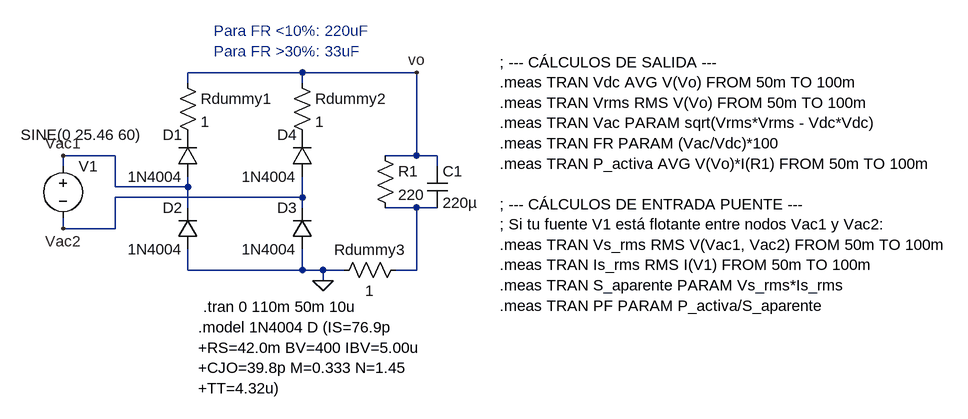
[diagram p0: schematic PuenteOndaCompleta RC.asc]
PuenteOndaCompleta RC.asc, the LTspice schematic file:
Version 4.1
SHEET 1 1284 680
WIRE 240 32 64 32
WIRE 416 32 240 32
WIRE 64 48 64 32
WIRE 240 48 240 32
WIRE -48 160 -128 160
WIRE 416 160 416 32
WIRE 416 160 368 160
WIRE 448 160 416 160
WIRE -128 176 -128 160
WIRE 448 176 448 160
WIRE -48 208 -48 160
WIRE 64 208 64 192
WIRE 64 208 -48 208
WIRE 240 224 240 192
WIRE 240 224 -48 224
WIRE 64 240 64 208
WIRE 240 240 240 224
WIRE 416 240 368 240
WIRE 448 240 416 240
WIRE -128 272 -128 256
WIRE -48 272 -48 224
WIRE -48 272 -128 272
WIRE 64 336 64 304
WIRE 240 336 240 304
WIRE 240 336 64 336
WIRE 272 336 240 336
WIRE 304 336 272 336
WIRE 416 336 416 240
WIRE 416 336 384 336
WIRE 272 352 272 336
FLAG 272 352 0
FLAG 416 32 vo
FLAG -128 160 Vac1
FLAG -128 272 Vac2
SYMBOL diode 80 192 R180
WINDOW 0 24 64 Left 2
WINDOW 3 24 0 Left 2
SYMATTR InstName D1
SYMATTR Value 1N4004
SYMBOL diode 80 304 R180
WINDOW 0 24 64 Left 2
WINDOW 3 24 0 Left 2
SYMATTR InstName D2
SYMATTR Value 1N4004
SYMBOL diode 256 304 R180
WINDOW 0 24 64 Left 2
WINDOW 3 24 0 Left 2
SYMATTR InstName D3
SYMATTR Value 1N4004
SYMBOL diode 256 192 R180
WINDOW 0 24 64 Left 2
WINDOW 3 24 0 Left 2
SYMATTR InstName D4
SYMATTR Value 1N4004
SYMBOL voltage -128 160 R0
WINDOW 3 -65 -32 Left 2
WINDOW 123 0 0 Left 0
WINDOW 39 0 0 Left 0
SYMATTR Value SINE(0 25.46 60)
SYMATTR InstName V1
SYMBOL res 48 32 R0
SYMATTR InstName Rdummy1
SYMATTR Value 1
SYMBOL res 224 32 R0
SYMATTR InstName Rdummy2
SYMATTR Value 1
SYMBOL res 400 320 R90
WINDOW 0 0 56 VBottom 2
WINDOW 3 32 56 VTop 2
SYMATTR InstName Rdummy3
SYMATTR Value 1
SYMBOL res 352 144 R0
SYMATTR InstName R1
SYMATTR Value 220
SYMBOL cap 432 176 R0
SYMATTR InstName C1
SYMATTR Value 220µ
TEXT 88 392 Left 2 !.tran 0 110m 50m 10u
TEXT 80 424 Left 2 !.model 1N4004 D (IS=76.9p \n+RS=42.0m BV=400 IBV=5.00u \n+CJO=39.8p M=0.333 N=1.45 \n+TT=4.32u)
TEXT 104 -32 Left 2 ;Para FR <10%: 220uF\nPara FR >30%: 33uF
TEXT 544 16 Left 2 !; --- CÁLCULOS DE SALIDA ---\n.meas TRAN Vdc AVG V(Vo) FROM 50m TO 100m\n.meas TRAN Vrms RMS V(Vo) FROM 50m TO 100m\n.meas TRAN Vac PARAM sqrt(Vrms*Vrms - Vdc*Vdc)\n.meas TRAN FR PARAM (Vac/Vdc)*100\n.meas TRAN P_activa AVG V(Vo)*I(R1) FROM 50m TO 100m\n \n; --- CÁLCULOS DE ENTRADA PUENTE ---\n; Si tu fuente V1 está flotante entre nodos Vac1 y Vac2:\n.meas TRAN Vs_rms RMS V(Vac1, Vac2) FROM 50m TO 100m\n.meas TRAN Is_rms RMS I(V1) FROM 50m TO 100m\n.meas TRAN S_aparente PARAM Vs_rms*Is_rms\n.meas TRAN PF PARAM P_activa/S_aparente

The netlist it stands for:
* PuenteOndaCompleta RC.asc
D1 Vac1 P001 1N4004
D2 0 Vac1 1N4004
D3 0 Vac2 1N4004
D4 Vac2 P002 1N4004
V1 Vac1 Vac2 SINE(0 25.46 60)
Rdummy1 vo P001 1
Rdummy2 vo P002 1
Rdummy3 N001 0 1
R1 vo N001 220
C1 vo N001 220µ
.model D D
.lib standard.dio
.tran 0 110m 50m 10u
.model 1N4004 D (IS=76.9p
+RS=42.0m BV=400 IBV=5.00u
+CJO=39.8p M=0.333 N=1.45
+TT=4.32u)
* Para FR <10%: 220uF
* Para FR >30%: 33uF
; --- CÁLCULOS DE SALIDA ---
.meas TRAN Vdc AVG V(Vo) FROM 50m TO 100m
.meas TRAN Vrms RMS V(Vo) FROM 50m TO 100m
.meas TRAN Vac PARAM sqrt(Vrms*Vrms - Vdc*Vdc)
.meas TRAN FR PARAM (Vac/Vdc)*100
.meas TRAN P_activa AVG V(Vo)*I(R1) FROM 50m TO 100m
; --- CÁLCULOS DE ENTRADA PUENTE ---
; Si tu fuente V1 está flotante entre nodos Vac1 y Vac2:
.meas TRAN Vs_rms RMS V(Vac1, Vac2) FROM 50m TO 100m
.meas TRAN Is_rms RMS I(V1) FROM 50m TO 100m
.meas TRAN S_aparente PARAM Vs_rms*Is_rms
.meas TRAN PF PARAM P_activa/S_aparente
.backanno
.end